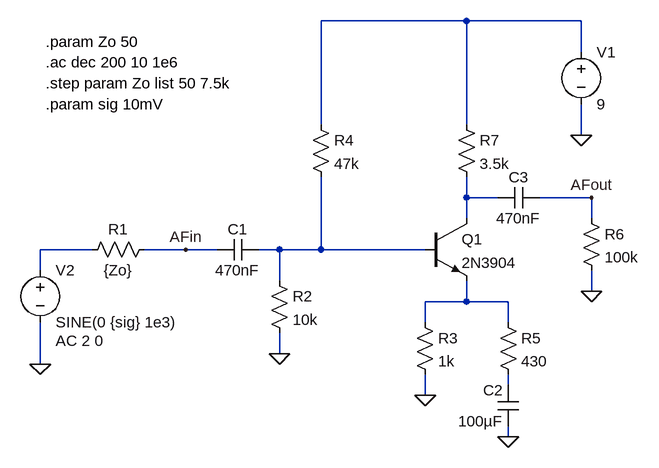
[diagram p0: schematic ECE521_CEamp.asc]
ECE521_CEamp.asc, the LTspice schematic file:
Version 4
SHEET 1 880 680
WIRE 400 -112 176 -112
WIRE 576 -112 400 -112
WIRE 576 -64 576 -112
WIRE 176 48 176 -112
WIRE 400 48 400 -112
WIRE 576 64 576 16
WIRE 400 160 400 128
WIRE 448 160 400 160
WIRE 592 160 512 160
WIRE 400 192 400 160
WIRE 592 192 592 160
WIRE -176 240 -256 240
WIRE -32 240 -96 240
WIRE 16 240 -32 240
WIRE 112 240 80 240
WIRE 176 240 176 128
WIRE 176 240 112 240
WIRE 336 240 176 240
WIRE -256 272 -256 240
WIRE 112 288 112 240
WIRE 592 304 592 272
WIRE 400 320 400 288
WIRE 400 320 336 320
WIRE 464 320 400 320
WIRE 336 352 336 320
WIRE 464 352 464 320
WIRE 112 400 112 368
WIRE -256 416 -256 352
WIRE 464 448 464 432
WIRE 336 464 336 432
WIRE 464 528 464 512
FLAG 112 400 0
FLAG 464 528 0
FLAG 336 464 0
FLAG -256 416 0
FLAG 576 64 0
FLAG -32 240 AFin
FLAG 592 304 0
FLAG 592 160 AFout
SYMBOL cap 80 224 R90
WINDOW 0 0 32 VBottom 2
WINDOW 3 32 32 VTop 2
SYMATTR InstName C1
SYMATTR Value 470nF
SYMBOL cap 480 512 R180
WINDOW 0 24 56 Left 2
WINDOW 3 24 8 Left 2
SYMATTR InstName C2
SYMATTR Value 100µF
SYMBOL cap 512 144 R90
WINDOW 0 0 32 VBottom 2
WINDOW 3 32 32 VTop 2
SYMATTR InstName C3
SYMATTR Value 470nF
SYMBOL npn 336 192 R0
SYMATTR InstName Q1
SYMATTR Value 2N3904
SYMBOL voltage 576 -80 R0
SYMATTR InstName V1
SYMATTR Value 9
SYMBOL voltage -256 256 R0
WINDOW 123 24 124 Left 2
WINDOW 39 0 0 Left 0
SYMATTR Value2 AC 2 0
SYMATTR InstName V2
SYMATTR Value SINE(0 {sig} 1e3)
SYMBOL res -80 224 R90
WINDOW 0 0 56 VBottom 2
WINDOW 3 32 56 VTop 2
SYMATTR InstName R1
SYMATTR Value {Zo}
SYMBOL res 96 272 R0
SYMATTR InstName R2
SYMATTR Value 10k
SYMBOL res 320 336 R0
SYMATTR InstName R3
SYMATTR Value 1k
SYMBOL res 160 32 R0
SYMATTR InstName R4
SYMATTR Value 47k
SYMBOL res 448 336 R0
SYMATTR InstName R5
SYMATTR Value 430
SYMBOL res 576 176 R0
SYMATTR InstName R6
SYMATTR Value 100k
SYMBOL res 384 32 R0
SYMATTR InstName R7
SYMATTR Value 3.5k
TEXT -248 -80 Left 2 !.param Zo 50
TEXT -248 -48 Left 2 !.ac dec 200 10 1e6
TEXT -248 -16 Left 2 !.step param Zo list 50 7.5k
TEXT -248 16 Left 2 !.param sig 10mV

The netlist it stands for:
* ECE521_CEamp.asc
C1 N004 AFin 470nF
C2 0 N006 100µF
C3 AFout N002 470nF
Q1 N002 N004 N005 0 2N3904
V1 N001 0 9
V2 N003 0 SINE(0 {sig} 1e3) AC 2 0
R1 AFin N003 {Zo}
R2 N004 0 10k
R3 N005 0 1k
R4 N001 N004 47k
R5 N005 N006 430
R6 AFout 0 100k
R7 N001 N002 3.5k
.model NPN NPN
.model PNP PNP
.lib standard.bjt
.param Zo 50
.ac dec 200 10 1e6
.step param Zo list 50 7.5k
.param sig 10mV
.backanno
.end